# Altium schematic sheet PWM_PULSE.SchDoc
size A4
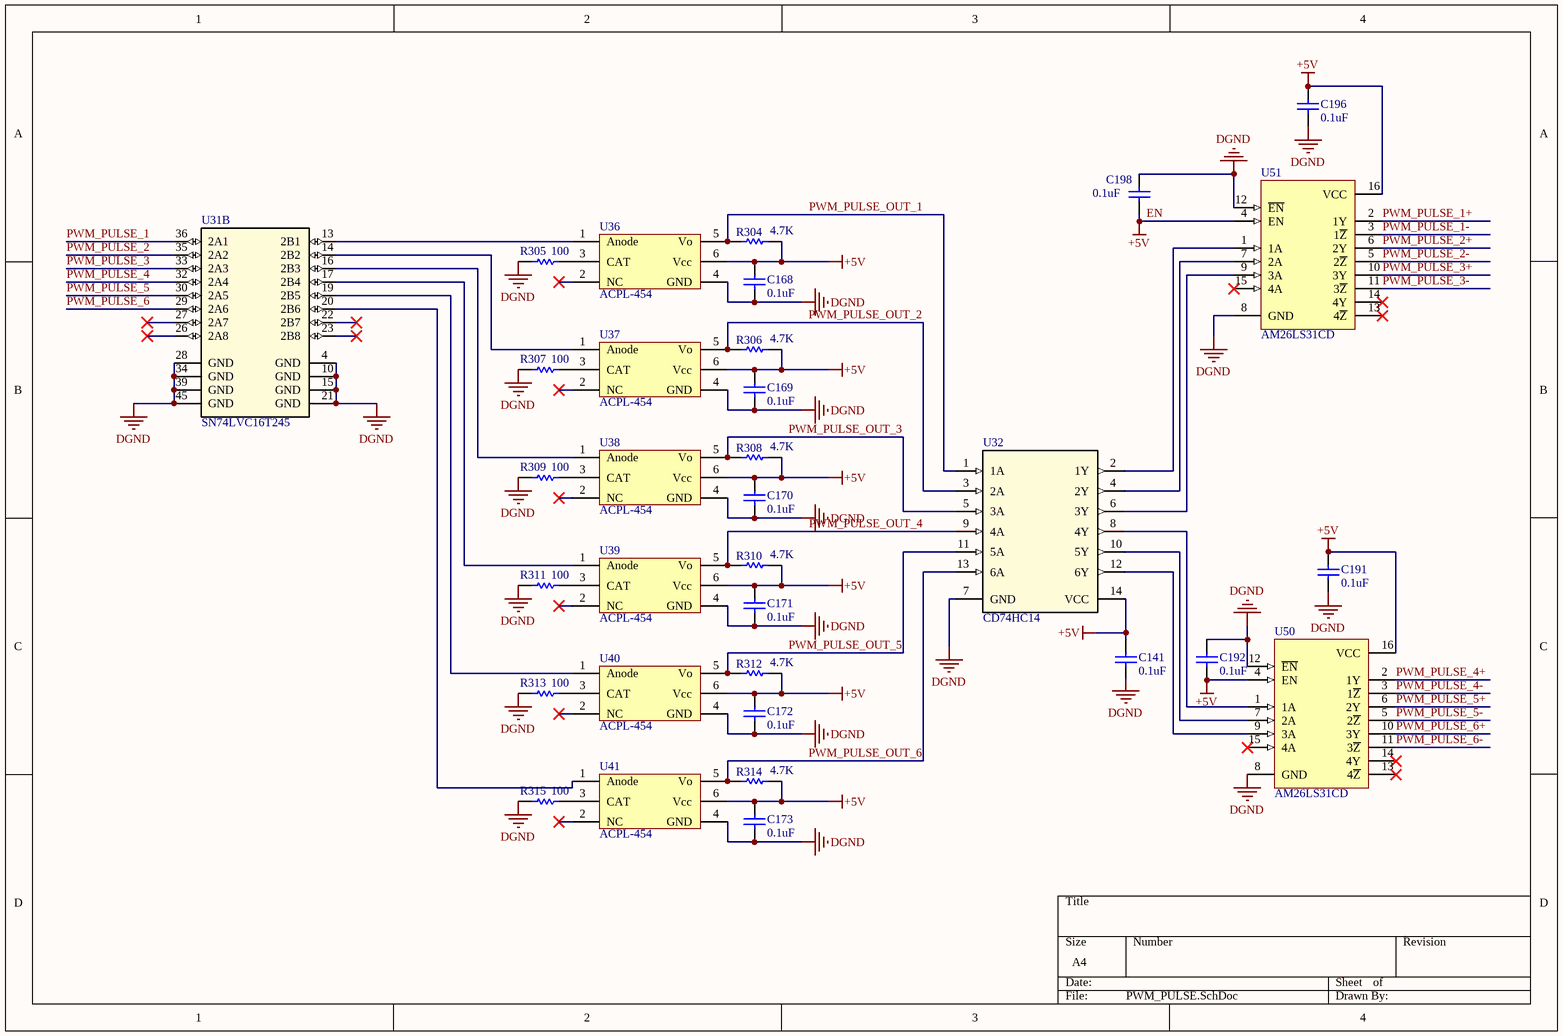
[diagram p0: PWM_PULSE.SchDoc]

## Parts
C141  value 0.1uF  [1608[0603]]  (hidden comment: Cap)
C168  value 0.1uF  [1608[0603]]  (hidden comment: Cap)
C169  value 0.1uF  [1608[0603]]  (hidden comment: Cap)
C170  value 0.1uF  [1608[0603]]  (hidden comment: Cap)
C171  value 0.1uF  [1608[0603]]  (hidden comment: Cap)
C172  value 0.1uF  [1608[0603]]  (hidden comment: Cap)
C173  value 0.1uF  [1608[0603]]  (hidden comment: Cap)
C191  value 0.1uF  [1608[0603]]  (hidden comment: Cap)
C192  value 0.1uF  [1608[0603]]  (hidden comment: Cap)
C196  value 0.1uF  [1608[0603]]  (hidden comment: Cap)
C198  value 0.1uF  [1608[0603]]  (hidden comment: Cap)
R304  value 4.7K  [1608[0603]]  (hidden comment: Res1)
R305  value 100  [1608[0603]]  (hidden comment: Res1)
R306  value 4.7K  [1608[0603]]  (hidden comment: Res1)
R307  value 100  [1608[0603]]  (hidden comment: Res1)
R308  value 4.7K  [1608[0603]]  (hidden comment: Res1)
R309  value 100  [1608[0603]]  (hidden comment: Res1)
R310  value 4.7K  [1608[0603]]  (hidden comment: Res1)
R311  value 100  [1608[0603]]  (hidden comment: Res1)
R312  value 4.7K  [1608[0603]]  (hidden comment: Res1)
R313  value 100  [1608[0603]]  (hidden comment: Res1)
R314  value 4.7K  [1608[0603]]  (hidden comment: Res1)
R315  value 100  [1608[0603]]  (hidden comment: Res1)
U31  SN74LVC16T245  [SN74LVC16T245_TSSOP]  (part B of 2)
U32  CD74HC14  [CD74HC14_SOIC]
U36  ACPL-454  [ACPL-P454]
U37  ACPL-454  [ACPL-P454]
U38  ACPL-454  [ACPL-P454]
U39  ACPL-454  [ACPL-P454]
U40  ACPL-454  [ACPL-P454]
U41  ACPL-454  [ACPL-P454]
U50  AM26LS31CD  [D016_N]
U51  AM26LS31CD  [D016_N]

## Nets
DGND: C141.1 C168.1 C169.1 C170.1 C171.1 C172.1 C173.1 C191.1 C192.2 C196.1 C198.2 R305.2 R307.2 R309.2 R311.2 R313.2 R315.2 U31.4(GND) U31.10(GND) U31.15(GND) U31.21(GND) U31.28(GND) U31.34(GND) U31.39(GND) U31.45(GND) U32.7(GND) U36.4(GND) U37.4(GND) U38.4(GND) U39.4(GND) U40.4(GND) U41.4(GND) U50.8(GND) U50.12(~{EN}) U51.8(GND) U51.12(~{EN})
EN: C141.2 C168.2 C169.2 C170.2 C171.2 C172.2 C173.2 C191.2 C192.1 C196.2 C198.1 R304.1 R306.1 R308.1 R310.1 R312.1 R314.1 U32.14(VCC) U36.6(Vcc) U37.6(Vcc) U38.6(Vcc) U39.6(Vcc) U40.6(Vcc) U41.6(Vcc) U50.4(EN) U50.16(VCC) U51.4(EN) U51.16(VCC)  [also labelled +5V]
PWM_PULSE_1: U31.36(2A1)
PWM_PULSE_1+: U51.2(1Y)
PWM_PULSE_1-: U51.3(1~{Z})
PWM_PULSE_2: U31.35(2A2)
PWM_PULSE_2+: U51.6(2Y)
PWM_PULSE_2-: U51.5(2~{Z})
PWM_PULSE_3: U31.33(2A3)
PWM_PULSE_3+: U51.10(3Y)
PWM_PULSE_3-: U51.11(3~{Z})
PWM_PULSE_4: U31.32(2A4)
PWM_PULSE_4+: U50.2(1Y)
PWM_PULSE_4-: U50.3(1~{Z})
PWM_PULSE_5: U31.30(2A5)
PWM_PULSE_5+: U50.6(2Y)
PWM_PULSE_5-: U50.5(2~{Z})
PWM_PULSE_6: U31.29(2A6)
PWM_PULSE_6+: U50.10(3Y)
PWM_PULSE_6-: U50.11(3~{Z})
PWM_PULSE_OUT_1: R304.2 U32.1(1A) U36.5(Vo)
PWM_PULSE_OUT_2: R306.2 U32.3(2A) U37.5(Vo)
PWM_PULSE_OUT_3: R308.2 U32.5(3A) U38.5(Vo)
PWM_PULSE_OUT_4: R310.2 U32.9(4A) U39.5(Vo)
PWM_PULSE_OUT_5: R312.2 U32.11(5A) U40.5(Vo)
PWM_PULSE_OUT_6: R314.2 U32.13(6A) U41.5(Vo)
NetR305_1: R305.1 U36.3(CAT)
NetR307_1: R307.1 U37.3(CAT)
NetR309_1: R309.1 U38.3(CAT)
NetR311_1: R311.1 U39.3(CAT)
NetR313_1: R313.1 U40.3(CAT)
NetR315_1: R315.1 U41.3(CAT)
NetU31_13: U31.13(2B1) U36.1(Anode)
NetU31_14: U31.14(2B2) U37.1(Anode)
NetU31_16: U31.16(2B3) U38.1(Anode)
NetU31_17: U31.17(2B4) U39.1(Anode)
NetU31_19: U31.19(2B5) U40.1(Anode)
NetU31_20: U31.20(2B6) U41.1(Anode)
NetU32_2: U32.2(1Y) U51.1(1A)
NetU32_4: U32.4(2Y) U51.7(2A)
NetU32_6: U32.6(3Y) U51.9(3A)
NetU32_8: U32.8(4Y) U50.1(1A)
NetU32_10: U32.10(5Y) U50.7(2A)
NetU32_12: U32.12(6Y) U50.9(3A)

Not connected (* = marked no-connect by the designer): U31 22(2B7)* 23(2B8)* 26(2A8)* 27(2A7)*; U36 2(NC)*; U37 2(NC)*; U38 2(NC)*; U39 2(NC)*; U40 2(NC)*; U41 2(NC)*; U50 13(4~{Z})* 14(4Y)* 15(4A)*; U51 13(4~{Z})* 14(4Y)* 15(4A)*

## Library data of the parts
C141 C168-C173 C191 C192 C196 C198 = Cap: Capacitor; Published: 8-Jun-2000; LatestRevisionDate: 17-Jul-2002; LatestRevisionNote: Re-released for DXP Platform.; PackageReference: RAD-0.3; Publisher: Altium Limited; PackageDescription: Radial Cap, Thru-Hole; 2 Leads; 0.3 in Pin Spacing
R304-R315 = Res1: Resistor; Published: 8-Jun-2000; LatestRevisionDate: 17-Jul-2002; LatestRevisionNote: Re-released for DXP Platform.; PackageReference: AXIAL-0.3; Publisher: Altium Limited; PackageDescription: Axial Device, Thru-Hole; 2 Leads; 0.3 in Pin Spacing
U31 = SN74LVC16T245_A
U32 = CD74HC14: Manufacturer: Texas Instruments; INDUSTRY_STD_PKG_TYPE: SOIC; FAMILY_NAME: INVERTING BUFFER/DRIVER; PIN_COUNT: 14; PACKAGE_DESIGNATOR: D; Datasheet_URL: http://www.ti.com/lit/gpn/CD74HC14; GENERIC_PART_NUMBER: CD74HC14; Value: Value; Type: Type; RefDes: RefDes
U50 U51 = AM26LS31CD: Quadruple Differential Line Driver; Published: 15-May-2002; LatestRevisionDate: 13-Apr-2006; LatestRevisionNote: IPC-7351 Footprint Added.; DatasheetVersion: May-1990; PackageVersion: Jan-1998; PackageReference: D016; Publisher: Altium Limited; PackageDescription: 16-Pin Small Outline Integrated Circuit 1.27 mm Pitch; Code_IPC: SOIC127P600-16; ComponentLink1Description: Manufacturer Link; ComponentLink1URL: http://www.ti.com/; ComponentLink2Description: Datasheet; ComponentLink2URL: http://www-s.ti.com/sc/ds/am26ls31.pdf